# Altium schematic sheet Carrier.SchDoc
size A1
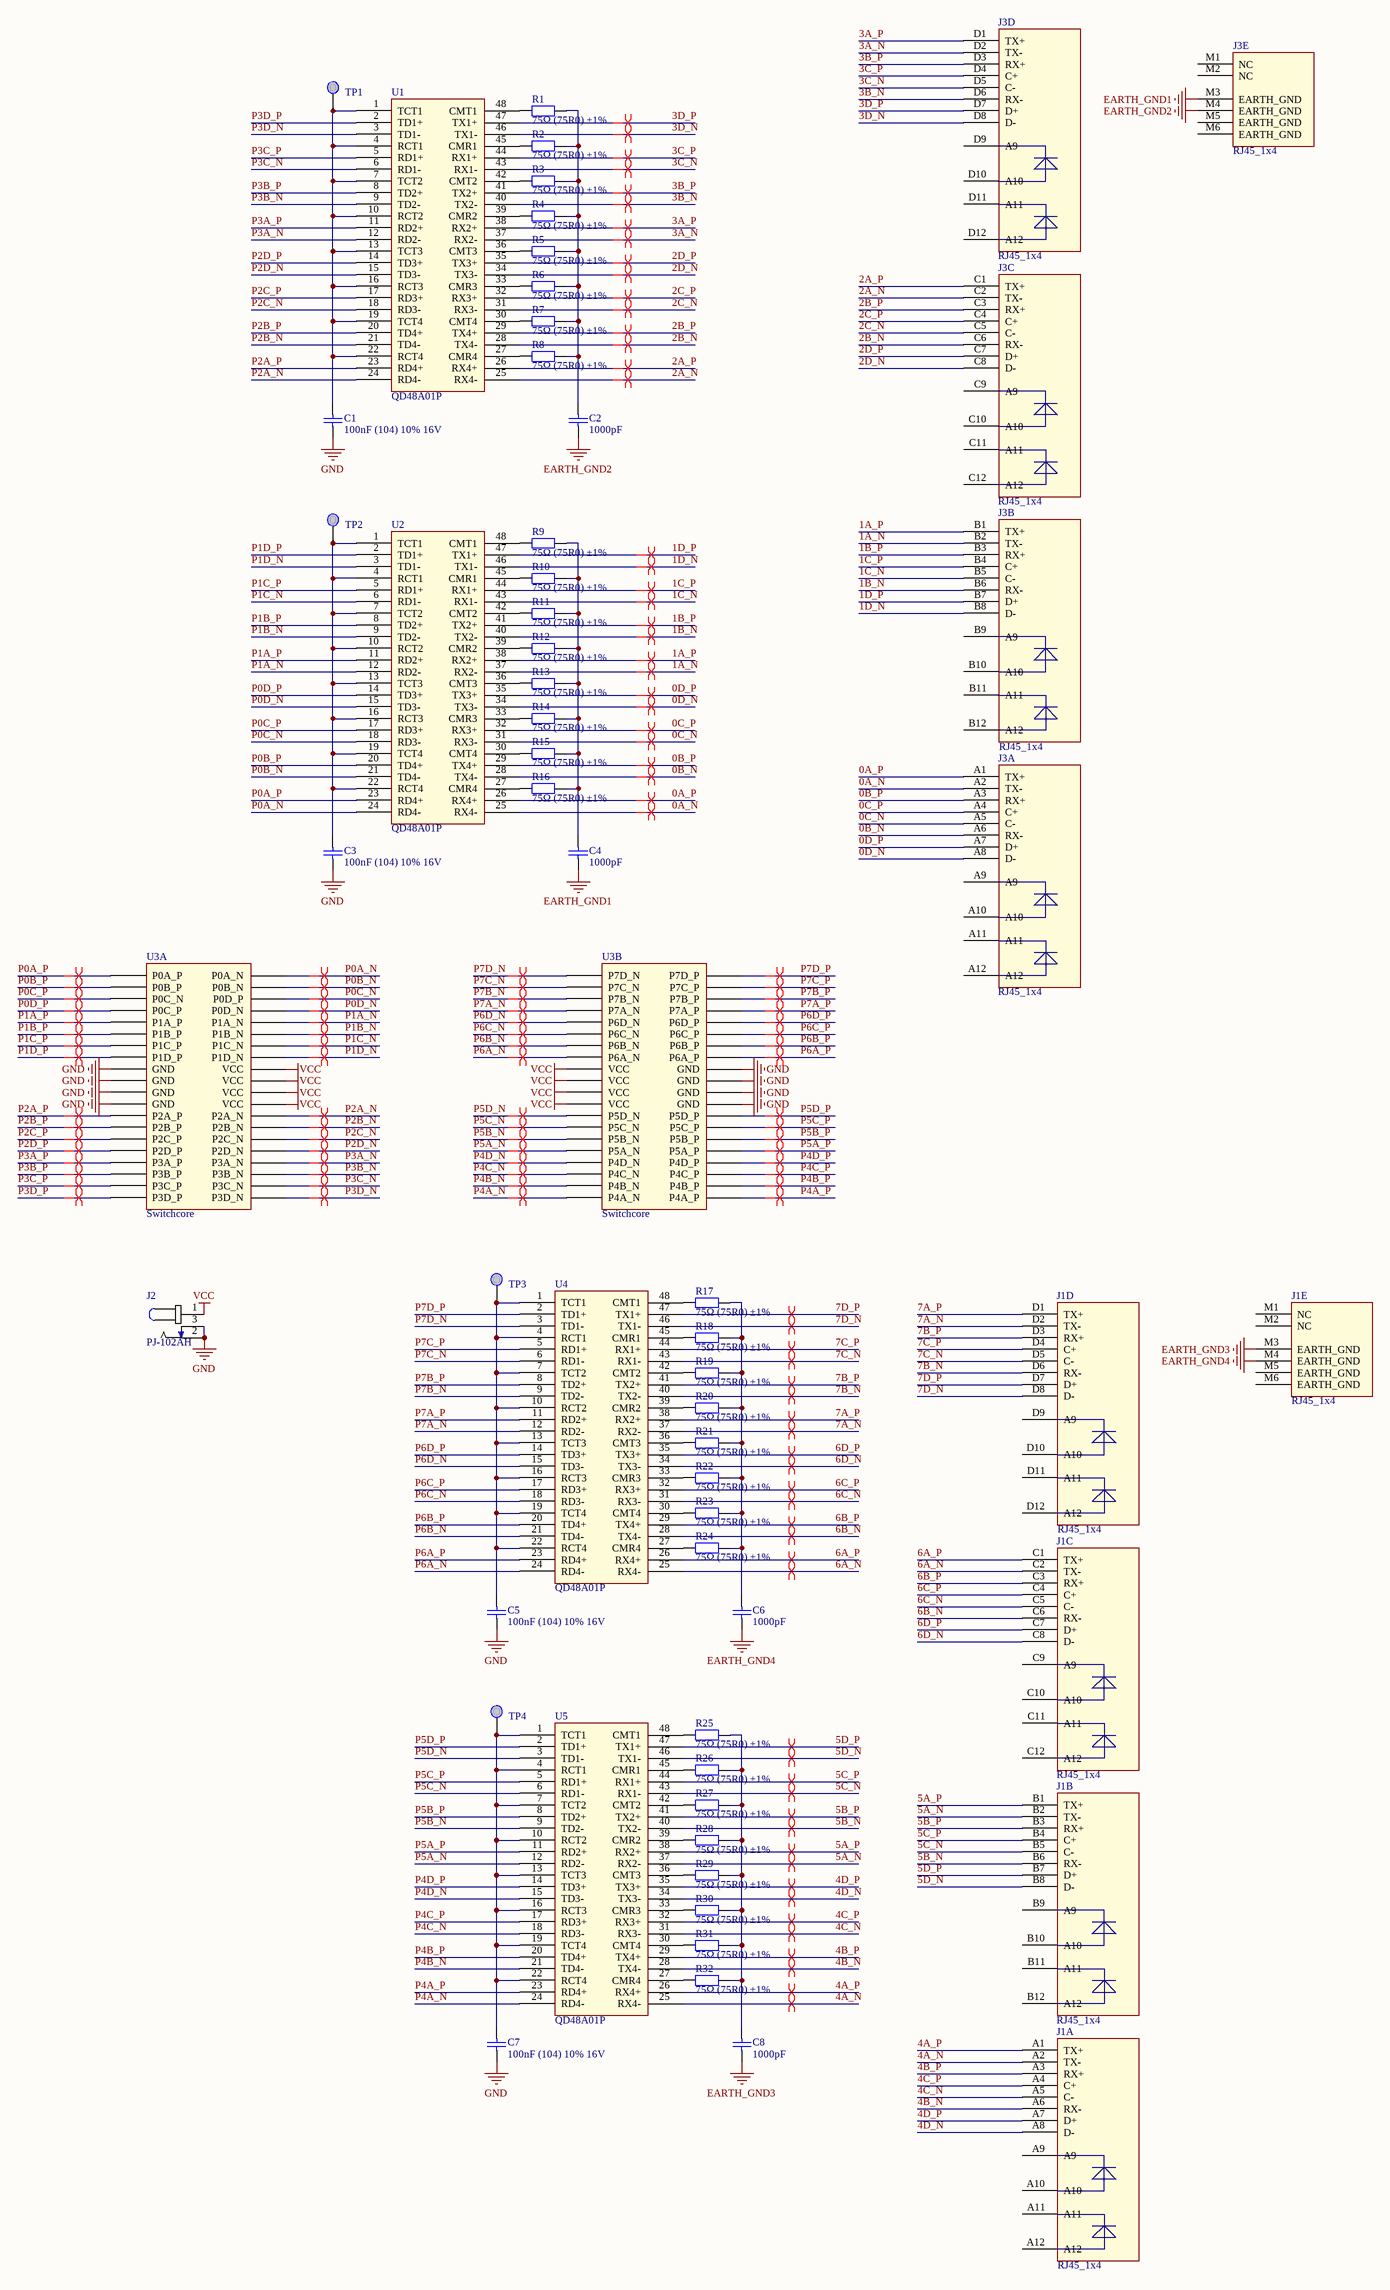
[diagram p0: Carrier.SchDoc]

## Parts
C1  100nF (104) 10% 16V  [0402_C]
C2  value 1000pF  [CAP1210N]  (hidden comment: Cap 1210)
C3  100nF (104) 10% 16V  [0402_C]
C4  value 1000pF  [CAP1210N]  (hidden comment: Cap 1210)
C5  100nF (104) 10% 16V  [0402_C]
C6  value 1000pF  [CAP1210N]  (hidden comment: Cap 1210)
C7  100nF (104) 10% 16V  [0402_C]
C8  value 1000pF  [CAP1210N]  (hidden comment: Cap 1210)
J1  RJ45_1x4  [RJ45-2-5406552-0]  (parts A,B,C,D,E of 5)
J2  PJ-102AH  [CUI_PJ-102AH]
J3  RJ45_1x4  [RJ45-2-5406552-0]  (parts A,B,C,D,E of 5)
R1  75Ω (75R0) ±1%  [0402_R]
R2  75Ω (75R0) ±1%  [0402_R]
R3  75Ω (75R0) ±1%  [0402_R]
R4  75Ω (75R0) ±1%  [0402_R]
R5  75Ω (75R0) ±1%  [0402_R]
R6  75Ω (75R0) ±1%  [0402_R]
R7  75Ω (75R0) ±1%  [0402_R]
R8  75Ω (75R0) ±1%  [0402_R]
R9  75Ω (75R0) ±1%  [0402_R]
R10  75Ω (75R0) ±1%  [0402_R]
R11  75Ω (75R0) ±1%  [0402_R]
R12  75Ω (75R0) ±1%  [0402_R]
R13  75Ω (75R0) ±1%  [0402_R]
R14  75Ω (75R0) ±1%  [0402_R]
R15  75Ω (75R0) ±1%  [0402_R]
R16  75Ω (75R0) ±1%  [0402_R]
R17  75Ω (75R0) ±1%  [0402_R]
R18  75Ω (75R0) ±1%  [0402_R]
R19  75Ω (75R0) ±1%  [0402_R]
R20  75Ω (75R0) ±1%  [0402_R]
R21  75Ω (75R0) ±1%  [0402_R]
R22  75Ω (75R0) ±1%  [0402_R]
R23  75Ω (75R0) ±1%  [0402_R]
R24  75Ω (75R0) ±1%  [0402_R]
R25  75Ω (75R0) ±1%  [0402_R]
R26  75Ω (75R0) ±1%  [0402_R]
R27  75Ω (75R0) ±1%  [0402_R]
R28  75Ω (75R0) ±1%  [0402_R]
R29  75Ω (75R0) ±1%  [0402_R]
R30  75Ω (75R0) ±1%  [0402_R]
R31  75Ω (75R0) ±1%  [0402_R]
R32  75Ω (75R0) ±1%  [0402_R]
TP1  Test Point, 30mil  [test_point_30_mil]  (value not drawn)
TP2  Test Point, 30mil  [test_point_30_mil]  (value not drawn)
TP3  Test Point, 30mil  [test_point_30_mil]  (value not drawn)
TP4  Test Point, 30mil  [test_point_30_mil]  (value not drawn)
U1  QD48A01P  [QD48A01P]
U2  QD48A01P  [QD48A01P]
U3  Switchcore  [SwitchCore]  (parts A,B of 2)
U4  QD48A01P  [QD48A01P]
U5  QD48A01P  [QD48A01P]

## Nets
EARTH_GND1: C4.1 J3.M3(EARTH_GND)
EARTH_GND2: C2.1 J3.M4(EARTH_GND)
EARTH_GND3: C8.1 J1.M3(EARTH_GND)
EARTH_GND4: C6.1 J1.M4(EARTH_GND)
GND: C1.1 C3.1 C5.1 C7.1 J2.2 J2.3 U3.A17(GND) U3.A19(GND) U3.A21(GND) U3.A23(GND) U3.B17(GND) U3.B19(GND) U3.B21(GND) U3.B23(GND)
VCC: J2.1 U3.A18(VCC) U3.A20(VCC) U3.A22(VCC) U3.A24(VCC) U3.B18(VCC) U3.B20(VCC) U3.B22(VCC) U3.B24(VCC)
0A_N: J3.A2(TX-) U2.25(RX4-)
0A_P: J3.A1(TX+) U2.26(RX4+)
0B_N: J3.A6(RX-) U2.28(TX4-)
0B_P: J3.A3(RX+) U2.29(TX4+)
0C_N: J3.A5(C-) U2.31(RX3-)
0C_P: J3.A4(C+) U2.32(RX3+)
0D_N: J3.A8(D-) U2.34(TX3-)
0D_P: J3.A7(D+) U2.35(TX3+)
1A_N: J3.B2(TX-) U2.37(RX2-)
1A_P: J3.B1(TX+) U2.38(RX2+)
1B_N: J3.B6(RX-) U2.40(TX2-)
1B_P: J3.B3(RX+) U2.41(TX2+)
1C_N: J3.B5(C-) U2.43(RX1-)
1C_P: J3.B4(C+) U2.44(RX1+)
1D_N: J3.B8(D-) U2.46(TX1-)
1D_P: J3.B7(D+) U2.47(TX1+)
2A_N: J3.C2(TX-) U1.25(RX4-)
2A_P: J3.C1(TX+) U1.26(RX4+)
2B_N: J3.C6(RX-) U1.28(TX4-)
2B_P: J3.C3(RX+) U1.29(TX4+)
2C_N: J3.C5(C-) U1.31(RX3-)
2C_P: J3.C4(C+) U1.32(RX3+)
2D_N: J3.C8(D-) U1.34(TX3-)
2D_P: J3.C7(D+) U1.35(TX3+)
3A_N: J3.D2(TX-) U1.37(RX2-)
3A_P: J3.D1(TX+) U1.38(RX2+)
3B_N: J3.D6(RX-) U1.40(TX2-)
3B_P: J3.D3(RX+) U1.41(TX2+)
3C_N: J3.D5(C-) U1.43(RX1-)
3C_P: J3.D4(C+) U1.44(RX1+)
3D_N: J3.D8(D-) U1.46(TX1-)
3D_P: J3.D7(D+) U1.47(TX1+)
4A_N: J1.A2(TX-) U5.25(RX4-)
4A_P: J1.A1(TX+) U5.26(RX4+)
4B_N: J1.A6(RX-) U5.28(TX4-)
4B_P: J1.A3(RX+) U5.29(TX4+)
4C_N: J1.A5(C-) U5.31(RX3-)
4C_P: J1.A4(C+) U5.32(RX3+)
4D_N: J1.A8(D-) U5.34(TX3-)
4D_P: J1.A7(D+) U5.35(TX3+)
5A_N: J1.B2(TX-) U5.37(RX2-)
5A_P: J1.B1(TX+) U5.38(RX2+)
5B_N: J1.B6(RX-) U5.40(TX2-)
5B_P: J1.B3(RX+) U5.41(TX2+)
5C_N: J1.B5(C-) U5.43(RX1-)
5C_P: J1.B4(C+) U5.44(RX1+)
5D_N: J1.B8(D-) U5.46(TX1-)
5D_P: J1.B7(D+) U5.47(TX1+)
6A_N: J1.C2(TX-) U4.25(RX4-)
6A_P: J1.C1(TX+) U4.26(RX4+)
6B_N: J1.C6(RX-) U4.28(TX4-)
6B_P: J1.C3(RX+) U4.29(TX4+)
6C_N: J1.C5(C-) U4.31(RX3-)
6C_P: J1.C4(C+) U4.32(RX3+)
6D_N: J1.C8(D-) U4.34(TX3-)
6D_P: J1.C7(D+) U4.35(TX3+)
7A_N: J1.D2(TX-) U4.37(RX2-)
7A_P: J1.D1(TX+) U4.38(RX2+)
7B_N: J1.D6(RX-) U4.40(TX2-)
7B_P: J1.D3(RX+) U4.41(TX2+)
7C_N: J1.D5(C-) U4.43(RX1-)
7C_P: J1.D4(C+) U4.44(RX1+)
7D_N: J1.D8(D-) U4.46(TX1-)
7D_P: J1.D7(D+) U4.47(TX1+)
P0A_N: U2.24(RD4-) U3.A2(P0A_N)
P0A_P: U2.23(RD4+) U3.A1(P0A_P)
P0B_N: U2.21(TD4-) U3.A4(P0B_N)
P0B_P: U2.20(TD4+) U3.A3(P0B_P)
P0C_N: U2.18(RD3-) U3.A6(P0D_P)
P0C_P: U2.17(RD3+) U3.A5(P0C_N)
P0D_N: U2.15(TD3-) U3.A8(P0D_N)
P0D_P: U2.14(TD3+) U3.A7(P0C_P)
P1A_N: U2.12(RD2-) U3.A10(P1A_N)
P1A_P: U2.11(RD2+) U3.A9(P1A_P)
P1B_N: U2.9(TD2-) U3.A12(P1B_N)
P1B_P: U2.8(TD2+) U3.A11(P1B_P)
P1C_N: U2.6(RD1-) U3.A14(P1C_N)
P1C_P: U2.5(RD1+) U3.A13(P1C_P)
P1D_N: U2.3(TD1-) U3.A16(P1D_N)
P1D_P: U2.2(TD1+) U3.A15(P1D_P)
P2A_N: U1.24(RD4-) U3.A26(P2A_N)
P2A_P: U1.23(RD4+) U3.A25(P2A_P)
P2B_N: U1.21(TD4-) U3.A28(P2B_N)
P2B_P: U1.20(TD4+) U3.A27(P2B_P)
P2C_N: U1.18(RD3-) U3.A30(P2C_N)
P2C_P: U1.17(RD3+) U3.A29(P2C_P)
P2D_N: U1.15(TD3-) U3.A32(P2D_N)
P2D_P: U1.14(TD3+) U3.A31(P2D_P)
P3A_N: U1.12(RD2-) U3.A34(P3A_N)
P3A_P: U1.11(RD2+) U3.A33(P3A_P)
P3B_N: U1.9(TD2-) U3.A36(P3B_N)
P3B_P: U1.8(TD2+) U3.A35(P3B_P)
P3C_N: U1.6(RD1-) U3.A38(P3C_N)
P3C_P: U1.5(RD1+) U3.A37(P3C_P)
P3D_N: U1.3(TD1-) U3.A40(P3D_N)
P3D_P: U1.2(TD1+) U3.A39(P3D_P)
P4A_N: U3.B2(P4A_N) U5.24(RD4-)
P4A_P: U3.B1(P4A_P) U5.23(RD4+)
P4B_N: U3.B4(P4B_N) U5.21(TD4-)
P4B_P: U3.B3(P4B_P) U5.20(TD4+)
P4C_N: U3.B6(P4C_N) U5.18(RD3-)
P4C_P: U3.B5(P4C_P) U5.17(RD3+)
P4D_N: U3.B8(P4D_N) U5.15(TD3-)
P4D_P: U3.B7(P4D_P) U5.14(TD3+)
P5A_N: U3.B10(P5A_N) U5.12(RD2-)
P5A_P: U3.B9(P5A_P) U5.11(RD2+)
P5B_N: U3.B12(P5B_N) U5.9(TD2-)
P5B_P: U3.B11(P5B_P) U5.8(TD2+)
P5C_N: U3.B14(P5C_N) U5.6(RD1-)
P5C_P: U3.B13(P5C_P) U5.5(RD1+)
P5D_N: U3.B16(P5D_N) U5.3(TD1-)
P5D_P: U3.B15(P5D_P) U5.2(TD1+)
P6A_N: U3.B26(P6A_N) U4.24(RD4-)
P6A_P: U3.B25(P6A_P) U4.23(RD4+)
P6B_N: U3.B28(P6B_N) U4.21(TD4-)
P6B_P: U3.B27(P6B_P) U4.20(TD4+)
P6C_N: U3.B30(P6C_N) U4.18(RD3-)
P6C_P: U3.B29(P6C_P) U4.17(RD3+)
P6D_N: U3.B32(P6D_N) U4.15(TD3-)
P6D_P: U3.B31(P6D_P) U4.14(TD3+)
P7A_N: U3.B34(P7A_N) U4.12(RD2-)
P7A_P: U3.B33(P7A_P) U4.11(RD2+)
P7B_N: U3.B36(P7B_N) U4.9(TD2-)
P7B_P: U3.B35(P7B_P) U4.8(TD2+)
P7C_N: U3.B38(P7C_N) U4.6(RD1-)
P7C_P: U3.B37(P7C_P) U4.5(RD1+)
P7D_N: U3.B40(P7D_N) U4.3(TD1-)
P7D_P: U3.B39(P7D_P) U4.2(TD1+)
NetC1_2: C1.2 TP1.0 U1.1(TCT1) U1.4(RCT1) U1.7(TCT2) U1.10(RCT2) U1.13(TCT3) U1.16(RCT3) U1.19(TCT4) U1.22(RCT4)
NetC2_2: C2.2 R1.2 R2.2 R3.2 R4.2 R5.2 R6.2 R7.2 R8.2
NetC3_2: C3.2 TP2.0 U2.1(TCT1) U2.4(RCT1) U2.7(TCT2) U2.10(RCT2) U2.13(TCT3) U2.16(RCT3) U2.19(TCT4) U2.22(RCT4)
NetC4_2: C4.2 R9.2 R10.2 R11.2 R12.2 R13.2 R14.2 R15.2 R16.2
NetC5_2: C5.2 TP3.0 U4.1(TCT1) U4.4(RCT1) U4.7(TCT2) U4.10(RCT2) U4.13(TCT3) U4.16(RCT3) U4.19(TCT4) U4.22(RCT4)
NetC6_2: C6.2 R17.2 R18.2 R19.2 R20.2 R21.2 R22.2 R23.2 R24.2
NetC7_2: C7.2 TP4.0 U5.1(TCT1) U5.4(RCT1) U5.7(TCT2) U5.10(RCT2) U5.13(TCT3) U5.16(RCT3) U5.19(TCT4) U5.22(RCT4)
NetC8_2: C8.2 R25.2 R26.2 R27.2 R28.2 R29.2 R30.2 R31.2 R32.2
NetR1_1: R1.1 U1.48(CMT1)
NetR2_1: R2.1 U1.45(CMR1)
NetR3_1: R3.1 U1.42(CMT2)
NetR4_1: R4.1 U1.39(CMR2)
NetR5_1: R5.1 U1.36(CMT3)
NetR6_1: R6.1 U1.33(CMR3)
NetR7_1: R7.1 U1.30(CMT4)
NetR8_1: R8.1 U1.27(CMR4)
NetR9_1: R9.1 U2.48(CMT1)
NetR10_1: R10.1 U2.45(CMR1)
NetR11_1: R11.1 U2.42(CMT2)
NetR12_1: R12.1 U2.39(CMR2)
NetR13_1: R13.1 U2.36(CMT3)
NetR14_1: R14.1 U2.33(CMR3)
NetR15_1: R15.1 U2.30(CMT4)
NetR16_1: R16.1 U2.27(CMR4)
NetR17_1: R17.1 U4.48(CMT1)
NetR18_1: R18.1 U4.45(CMR1)
NetR19_1: R19.1 U4.42(CMT2)
NetR20_1: R20.1 U4.39(CMR2)
NetR21_1: R21.1 U4.36(CMT3)
NetR22_1: R22.1 U4.33(CMR3)
NetR23_1: R23.1 U4.30(CMT4)
NetR24_1: R24.1 U4.27(CMR4)
NetR25_1: R25.1 U5.48(CMT1)
NetR26_1: R26.1 U5.45(CMR1)
NetR27_1: R27.1 U5.42(CMT2)
NetR28_1: R28.1 U5.39(CMR2)
NetR29_1: R29.1 U5.36(CMT3)
NetR30_1: R30.1 U5.33(CMR3)
NetR31_1: R31.1 U5.30(CMT4)
NetR32_1: R32.1 U5.27(CMR4)

Not connected (* = marked no-connect by the designer): J1 A9 A10 A11 A12 B9(A9) B10(A10) B11(A11) B12(A12) C9(A9) C10(A10) C11(A11) C12(A12) D9(A9) D10(A10) D11(A11) D12(A12) M1(NC) M2(NC) M5(EARTH_GND) M6(EARTH_GND); J3 A9 A10 A11 A12 B9(A9) B10(A10) B11(A11) B12(A12) C9(A9) C10(A10) C11(A11) C12(A12) D9(A9) D10(A10) D11(A11) D12(A12) M1(NC) M2(NC) M5(EARTH_GND) M6(EARTH_GND)

## Layout directives
differential pair: 0A_N, 0A_P, 0B_N, 0B_P, 0C_N, 0C_P, 0D_N, 0D_P, 1A_N, 1A_P, 1B_N, 1B_P, 1C_N, 1C_P, 1D_N, 1D_P, 2A_N, 2A_P, 2B_N, 2B_P, 2C_N, 2C_P, 2D_N, 2D_P, 3A_N, 3A_P, 3B_N, 3B_P, 3C_N, 3C_P, 3D_N, 3D_P, 4A_N, 4A_P, 4B_N, 4B_P, 4C_N, 4C_P, 4D_N, 4D_P, 5A_N, 5A_P, 5B_N, 5B_P, 5C_N, 5C_P, 5D_N, 5D_P, 6A_N, 6A_P, 6B_N, 6B_P, 6C_N, 6C_P, 6D_N, 6D_P, 7A_N, 7A_P, 7B_N, 7B_P, 7C_N, 7C_P, 7D_N, 7D_P, P0A_N, P0A_P, P0B_N, P0B_P, P0C_N, P0C_P, P0D_N, P0D_P, P1A_N, P1A_P, P1B_N, P1B_P, P1C_N, P1C_P, P1D_N, P1D_P, P2A_N, P2A_P, P2B_N, P2B_P, P2C_N, P2C_P, P2D_N, P2D_P, P3A_N, P3A_P, P3B_N, P3B_P, P3C_N, P3C_P, P3D_N, P3D_P, P4A_N, P4A_P, P4B_N, P4B_P, P4C_N, P4C_P, P4D_N, P4D_P, P5A_N, P5A_P, P5B_N, P5B_P, P5C_N, P5C_P, P5D_N, P5D_P, P6A_N, P6A_P, P6B_N, P6B_P, P6C_N, P6C_P, P6D_N, P6D_P, P7A_N, P7A_P, P7B_N, P7B_P, P7C_N, P7C_P, P7D_N, P7D_P

## Library data of the parts
C1 C3 C5 C7 = 0402 100nF (104) 10% 16V: 贴片电容; ComponentLink1Description: 供应商链接; ComponentLink1URL: http://www.szlcsc.com/product/details_1877.html; Package: 0402; Supplier: LC; SuppliersPartNumber: C1525
C2 C4 C6 C8 = CAP 1000pF ±10% 2000V (2kV) Ceramic Capacitor X7R 1210 (3225 Metric): Manufacturer: Samsung Electro-Mechanics; Manufacturer Part Number: CL32B102KJFNNNE; Unit Price in Quantity: .0884; Part Number: CAP 1000pF ±10% 2000V (2kV) Ceramic Capacitor X7R 1210 (3225 Metric); Component Type: Standard; Voltage - Rated: 2000V; Mounting Type: smt; Supplier 1: Digikey; Supplier 1 Part Number: 1276-3316-6-ND; Part URL-Supplier 1: https://www.digikey.com/product-detail/en/samsung-electro-mechanics/CL32B102KJFNNNE/1276-3316-6-ND/3893831; Unit Price-Supplier 1: .34; Price Break: 1000; Vendor/Distributor: Digikey; Package: 1210
J2 = PJ-102AH: 2.0 mm Center Pin, 5.0 A, Right Angle, Through Hole, Tapered Pins, Dc Power Jack Connector; MF: CUI Inc.; SnapEDA_Link: https://www.snapeda.com/parts/PJ-102AH/CUI%20Inc./view-part/?ref=snap; Digi-Key_Part_Number: CP-102AH-ND; CUI_purchase_URL: https://www.cui.com/product/interconnect/dc-power-connectors/jacks/2.0-mm-center-pin/pj-102ah?utm_source=snapeda.com&utm_medium=referral&utm_campaign=snapedaBOM; Package: None; Digi-Key_Purchase_URL: https://www.digikey.com/product-detail/en/cui-inc/PJ-102AH/CP-102AH-ND/408448?utm_source=snapeda&utm_medium=aggregator&utm_campaign=symbol; MP: PJ-102AH; Value: *
R1-R32 = 0402 75Ω (75R0) 1%: 贴片电阻; ComponentLink1Description: 供应商链接; ComponentLink1URL: http://www.szlcsc.com/product/details_25876.html; Package: 0402; Supplier: LC; SuppliersPartNumber: C25133
TP1-TP4 = Test Point, 30mil: Designator: TP?; Part Number: Test Point, 30mil; Component Type: Standard (No BOM)